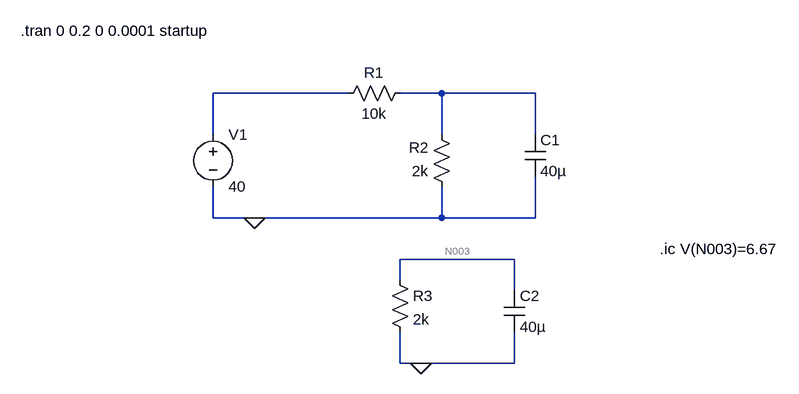
[diagram p0: schematic Q7_6.asc]
Q7_6.asc, the LTspice schematic file:
Version 4
SHEET 1 988 680
WIRE 304 64 96 64
WIRE 448 64 384 64
WIRE 592 64 448 64
WIRE 96 128 96 64
WIRE 448 128 448 64
WIRE 592 128 592 64
WIRE 96 256 96 208
WIRE 160 256 96 256
WIRE 448 256 448 208
WIRE 448 256 160 256
WIRE 592 256 592 192
WIRE 592 256 448 256
WIRE 560 320 384 320
WIRE 384 352 384 320
WIRE 560 368 560 320
WIRE 384 480 384 432
WIRE 416 480 384 480
WIRE 560 480 560 432
WIRE 560 480 416 480
FLAG 160 256 0
FLAG 416 480 0
SYMBOL voltage 96 112 R0
WINDOW 123 0 0 Left 0
WINDOW 39 0 0 Left 0
SYMATTR InstName V1
SYMATTR Value 40
SYMBOL res 400 48 R90
WINDOW 0 0 56 VBottom 2
WINDOW 3 32 56 VTop 2
SYMATTR InstName R1
SYMATTR Value 10k
SYMBOL res 464 224 R180
WINDOW 0 36 76 Left 2
WINDOW 3 36 40 Left 2
SYMATTR InstName R2
SYMATTR Value 2k
SYMBOL cap 576 128 R0
SYMATTR InstName C1
SYMATTR Value 40µ
SYMBOL res 368 336 R0
SYMATTR InstName R3
SYMATTR Value 2k
SYMBOL cap 544 368 R0
SYMATTR InstName C2
SYMATTR Value 40µ
TEXT -200 -32 Left 2 !.tran 0 0.2 0 0.0001 startup
TEXT 784 304 Left 2 !.ic V(N003)=6.67

The netlist it stands for:
* Q7_6.asc
V1 N001 0 40
R1 N002 N001 10k
R2 0 N002 2k
C1 N002 0 40µ
R3 N003 0 2k
C2 N003 0 40µ
.tran 0 0.2 0 0.0001 startup
.ic V(N003)=6.67
.backanno
.end